# Altium schematic sheet LM2576电源电路.SchDoc
size A4
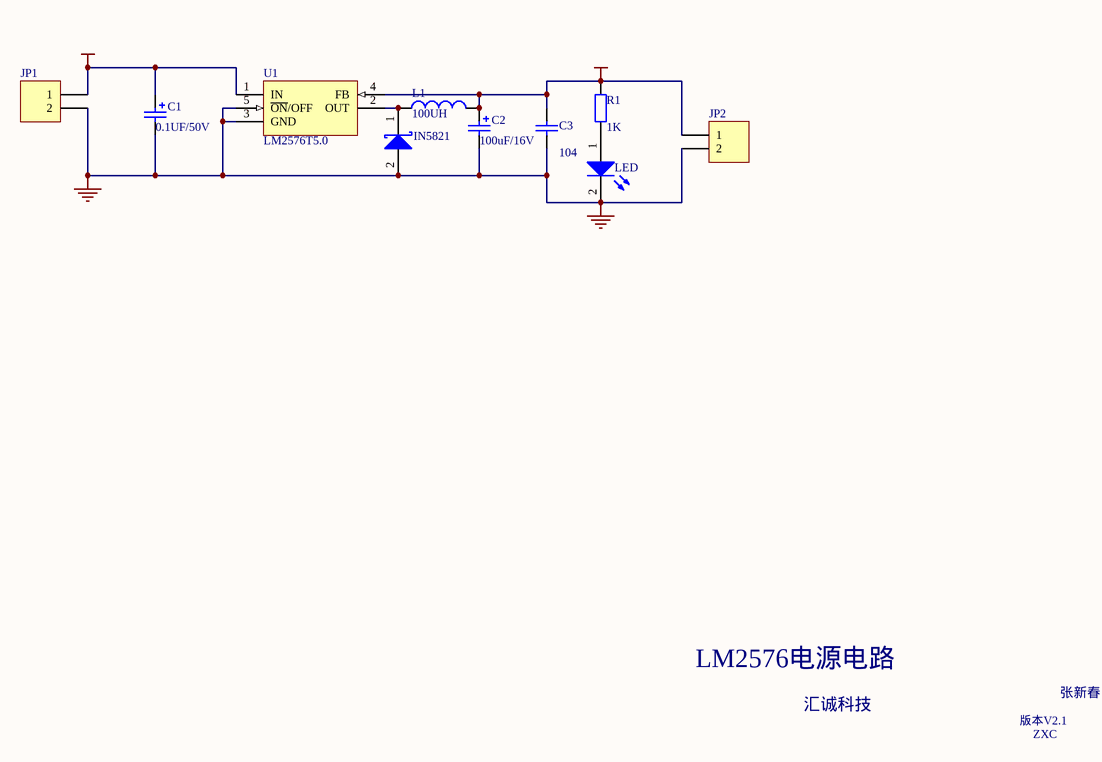
[diagram p0: LM2576电源电路.SchDoc]

## Parts
C1  value 0.1UF/50V  [C-DJ-6]  (hidden comment: DJDR)
C2  value 100uF/16V  [C-DJ-6]  (hidden comment: DJDR)
C3  value 104  [CPDR]  (hidden comment: CPDR)
DS1  LED  [LED_D]
IN5821  WY2JG  [ZCDZL]  (value not drawn)
JP1  PZ_2  [JIKEKE]  (value not drawn)
JP2  PZ_2  [JIKEKE]  (value not drawn)
L1  value 100UH  [L_DG]  (hidden comment: DG)
R1  value 1K  [RSE]  (hidden comment: Res)
U1  LM2576T5.0  [T05A]

## Nets
+5V: C2.1 C3.2 JP2.1 L1.2 R1.2 U1.4(FB)
GND: C1.2 C2.2 C3.1 DS1.2(K) IN5821.2(K) JP1.2 JP2.2 U1.3(GND) U1.5(~{ON}/OFF)
VCC: C1.1 JP1.1 U1.1(IN)
NetDS1_1: DS1.1(A) R1.1
NetIN5821_1: IN5821.1(A) L1.1 U1.2(OUT)

## Notes on the sheet
- LM2576电源电路
- 汇诚科技
- 版本V2.1
- 张新春
- ZXC

## Library data of the parts
C1 C2 = DJDR: 电解电容; Published: 8-Jun-2000; LatestRevisionDate: 17-Jul-2002; LatestRevisionNote: Re-released for DXP Platform.; Publisher: Altium Limited
C3 = CPDR: 瓷片电容; Published: 8-Jun-2000; LatestRevisionDate: 17-Jul-2002; LatestRevisionNote: Re-released for DXP Platform.; Publisher: Altium Limited
DS1 = LED: 发光二极管; Published: 8-Jun-2000; LatestRevisionDate: 17-Jul-2002; LatestRevisionNote: Re-released for DXP Platform.; Publisher: Altium Limited
IN5821 = WY2JG: 稳压二级管; Published: 8-Jun-2000; LatestRevisionDate: 17-Jul-2002; LatestRevisionNote: Re-released for DXP Platform.; Publisher: Altium Limited; Code_JEDEC: DO-214-AA
JP1 JP2 = PZ_2: 排针——2; LatestRevisionDate: 17-Jul-2002; LatestRevisionNote: Re-released for DXP Platform.; Publisher: Altium Limited
L1 = DG: 电感; Code_IEC: 1005; Published: 8-Jun-2000; LatestRevisionDate: 17-Jul-2002; LatestRevisionNote: Re-released for DXP Platform.; PackageReference: 0402-A; Publisher: Altium Limited; Code_JEITA: 0402
R1 = Res: 电阻; Published: 8-Jun-2000; LatestRevisionDate: 17-Jul-2002; LatestRevisionNote: Re-released for DXP Platform.; Publisher: Altium Limited
U1 = LM2576HVT-3.3: Simple Switcher 3A Step Down Voltage Regulator; PackageDocument: 2000; Note: Tab is connected to GND; Published: 15-Apr-2002; DatasheetDocument: Jun-1999; PackageReference: T05A; Publisher: Altium Limited; Code_JEDEC: TS-001-AA; ComponentLink1Description: Manufacturer Link; ComponentLink1URL: http://www.national.com/